# EAGLE schematic Lichtsteuerung (EAGLE 8.3.2)
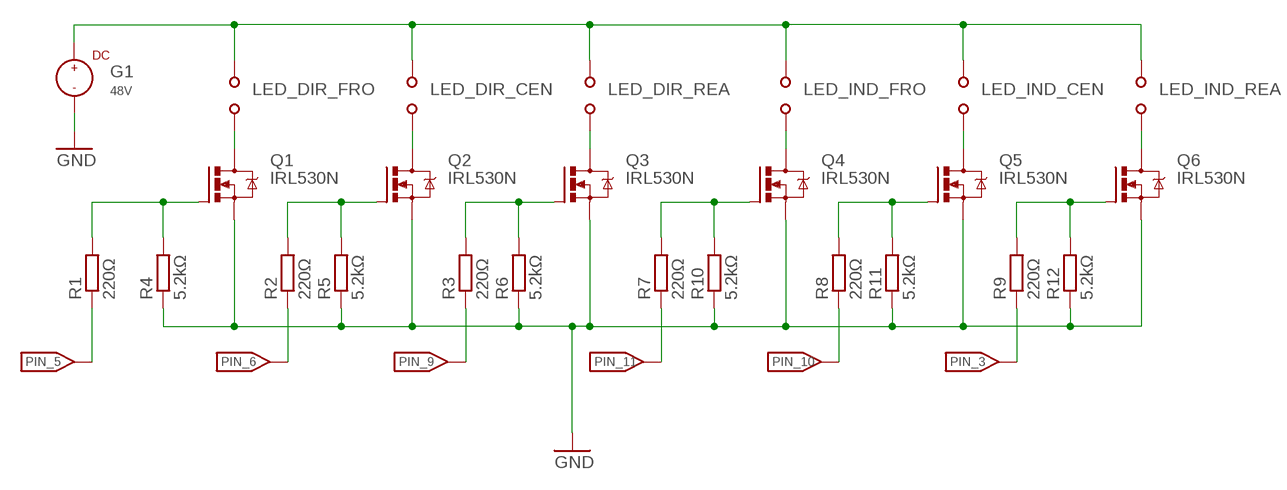
[diagram p0: schematic, sheet 1]

## Parts
G1  48V  DC-POWER  [TEMP_2]
Q1  IRL530N  [TO220BV]
Q2  IRL530N  [TO220BV]
Q3  IRL530N  [TO220BV]
Q4  IRL530N  [TO220BV]
Q5  IRL530N  [TO220BV]
Q6  IRL530N  [TO220BV]
R1  220Ω  R-EU_0204/2V  [0204V]
R2  220Ω  R-EU_0204/2V  [0204V]
R3  220Ω  R-EU_0204/2V  [0204V]
R4  5.2kΩ  R-EU_0204/2V  [0204V]
R5  5.2kΩ  R-EU_0204/2V  [0204V]
R6  5.2kΩ  R-EU_0204/2V  [0204V]
R7  220Ω  R-EU_0204/2V  [0204V]
R8  220Ω  R-EU_0204/2V  [0204V]
R9  220Ω  R-EU_0204/2V  [0204V]
R10  5.2kΩ  R-EU_0204/2V  [0204V]
R11  5.2kΩ  R-EU_0204/2V  [0204V]
R12  5.2kΩ  R-EU_0204/2V  [0204V]

## Nets
N$1: R1.1
N$2: Q1.S Q2.S Q3.S Q4.S Q5.S Q6.S R4.1 R5.1 R6.1 R10.1 R11.1 R12.1
N$3: Q1.D
N$4: Q3.D
N$5: Q2.D
N$7: Q1.G R1.2 R4.2
N$8: Q2.G R2.2 R5.2
N$9: Q3.G R3.2 R6.2
N$11: R3.1
N$12: R2.1
N$13: R7.1
N$14: Q4.D
N$15: Q6.D
N$16: Q5.D
N$19: Q4.G R7.2 R10.2
N$20: Q5.G R8.2 R11.2
N$21: Q6.G R9.2 R12.2
N$23: R9.1
N$24: R8.1

## Library data of the parts
G1 = flo's lib( for Lab):DC-POWER: DC Power Source
Q1-Q6 = IRF530N:IRL530N: HEXFET Power MOSFET
R1-R12 = resistor:R-EU_: RESISTOR, European symbol